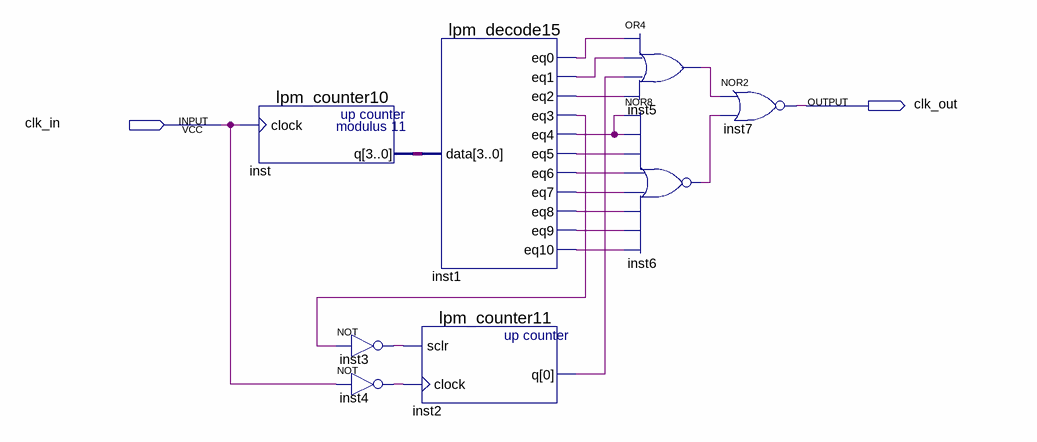
[diagram p0: schematic sheet]
// Quartus schematic Block2.bdf as structural Verilog: 8 symbols, 2 pins
module Block2 (
  input  clk_in,
  output clk_out
);

  wire inst1_eq0, inst1_eq1, inst1_eq2, inst1_eq3, inst1_eq4, inst1_eq5, inst1_eq6, inst1_eq7, inst1_eq8,
       inst1_eq9, inst1_eq10, inst2_q, inst3_out, inst4_out, inst5_out, inst6_out;
  wire [3:0] inst_q;

  lpm_counter10 inst (.clock(clk_in), .q(inst_q));
  not inst3 (inst3_out, inst1_eq3);
  not inst4 (inst4_out, clk_in);
  lpm_decode15 inst1 (
    .data(inst_q), .eq0(inst1_eq0), .eq1(inst1_eq1), .eq2(inst1_eq2), .eq3(inst1_eq3), .eq4(inst1_eq4),
    .eq5(inst1_eq5), .eq6(inst1_eq6), .eq7(inst1_eq7), .eq8(inst1_eq8), .eq9(inst1_eq9), .eq10(inst1_eq10));
  lpm_counter11 inst2 (.sclr(inst3_out), .clock(inst4_out), .q(inst2_q));
  or inst5 (inst5_out, inst1_eq0, inst1_eq1, inst2_q, inst1_eq2);
  nor inst6 (inst6_out, inst1_eq4, inst1_eq4, inst1_eq5, inst1_eq6, inst1_eq7, inst1_eq8, inst1_eq9, inst1_eq10);
  nor inst7 (clk_out, inst5_out, inst6_out);
endmodule
